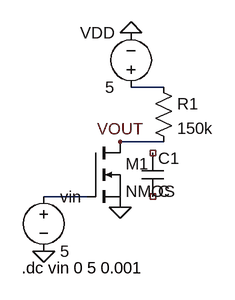
[diagram p0: schematic Draft1.asc]
Draft1.asc, the LTspice schematic file:
Version 4.1
SHEET 1 880 680
WIRE 48 -64 0 -64
WIRE 48 16 -16 16
WIRE -64 96 -128 96
FLAG -16 112 0
FLAG -128 176 0
FLAG 0 -144 0
FLAG -16 16 VOUT
SYMBOL nmos -64 16 R0
SYMATTR InstName M1
SYMBOL voltage 0 -48 R180
WINDOW 0 24 96 Left 2
WINDOW 3 24 16 Left 2
WINDOW 123 0 0 Left 0
WINDOW 39 0 0 Left 0
SYMATTR InstName VDD
SYMATTR Value 5
SYMBOL voltage -128 80 R0
WINDOW 123 0 0 Left 0
WINDOW 39 0 0 Left 0
SYMATTR InstName vin
SYMATTR Value 5
SYMBOL res 32 -80 R0
SYMATTR InstName R1
SYMATTR Value 150k
SYMBOL cap 16 32 R0
SYMATTR InstName C1
TEXT -160 200 Left 2 !.dc vin 0 5 0.001

The netlist it stands for:
* Draft1.asc
M1 VOUT N002 0 0 NMOS
VDD N001 0 5
vin N002 0 5
R1 N001 VOUT 150k
C1 NC_01 NC_02 C
.model NMOS NMOS
.model PMOS PMOS
.lib standard.mos
.dc vin 0 5 0.001
.backanno
.end